# Altium schematic sheet llrf_afe_dds_channel.SchDoc
size 209 x 297 mm; SheetNumber: 2; SheetTotal: 17
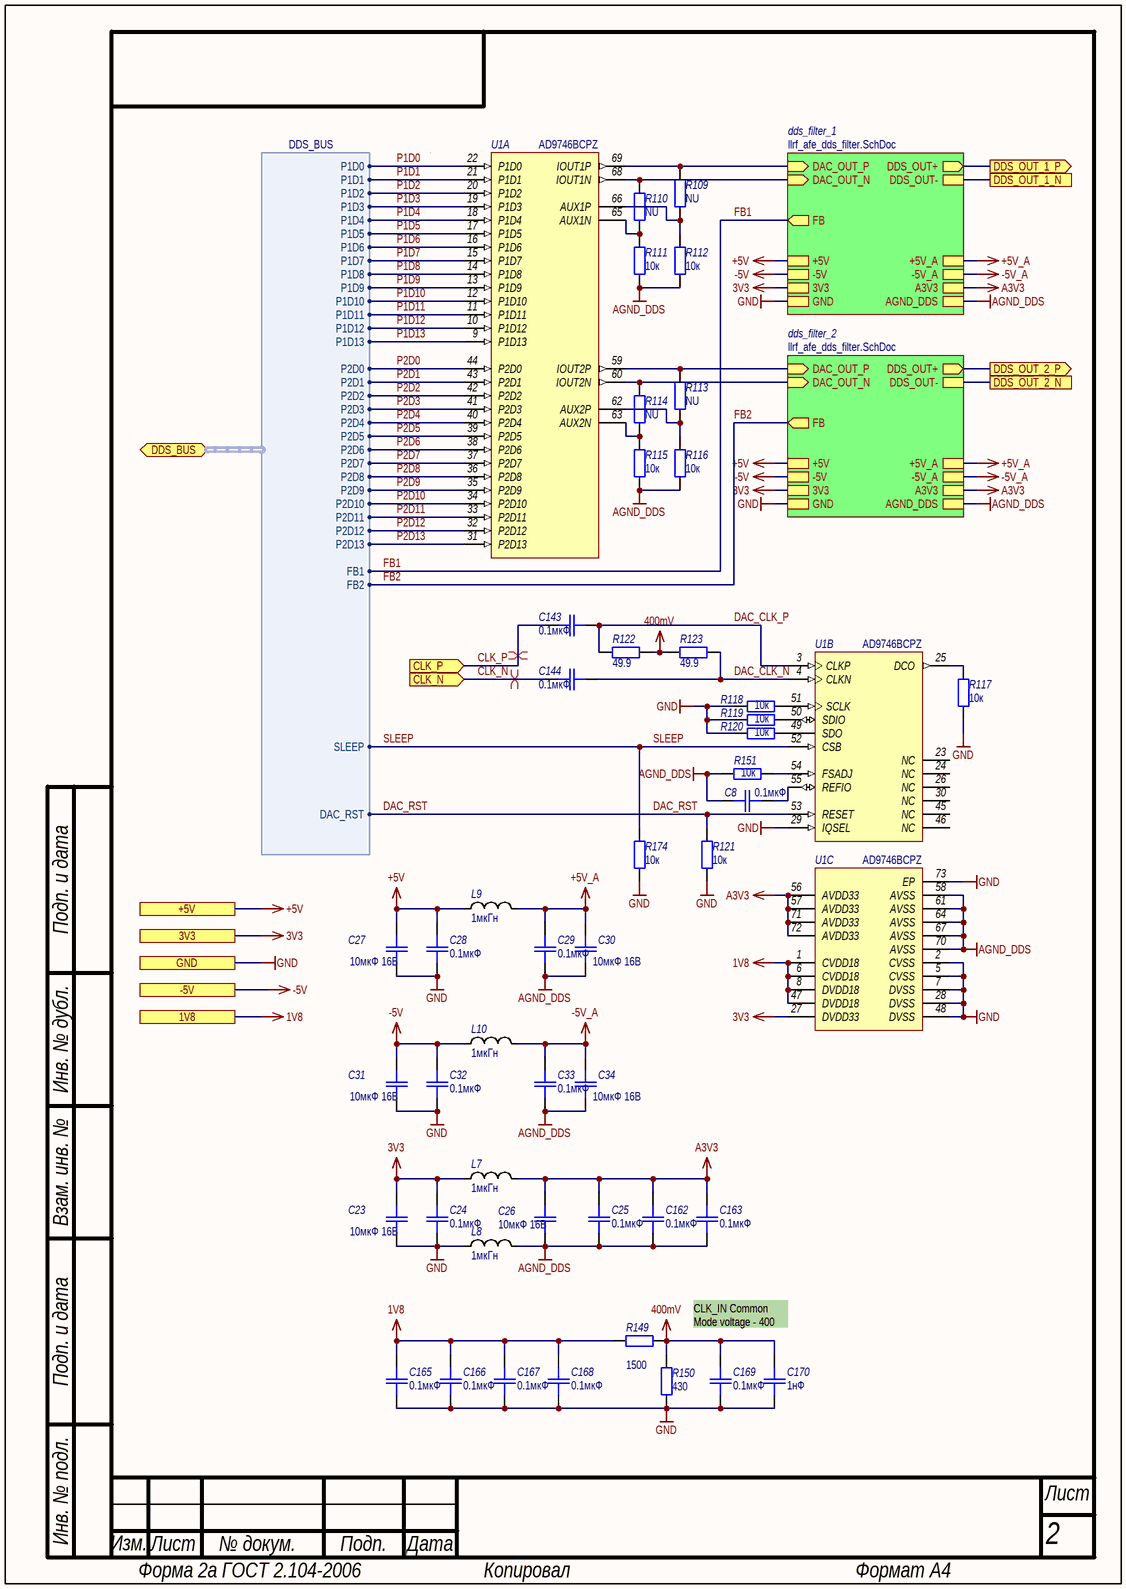
[diagram p0: llrf_afe_dds_channel.SchDoc]

## Parts
C8  0.1мкФ  [SMD_C0402]
C23  10мкФ 16В  [SMD_C0603]
C24  0.1мкФ  [SMD_C0402]
C25  0.1мкФ  [SMD_C0402]
C26  10мкФ 16В  [SMD_C0603]
C27  10мкФ 16В  [SMD_C0603]
C28  0.1мкФ  [SMD_C0402]
C29  0.1мкФ  [SMD_C0402]
C30  10мкФ 16В  [SMD_C0603]
C31  10мкФ 16В  [SMD_C0603]
C32  0.1мкФ  [SMD_C0402]
C33  0.1мкФ  [SMD_C0402]
C34  10мкФ 16В  [SMD_C0603]
C143  0.1мкФ  [SMD_C0402]
C144  0.1мкФ  [SMD_C0402]
C162  0.1мкФ  [SMD_C0402]
C163  0.1мкФ  [SMD_C0402]
C165  0.1мкФ  [SMD_C0402]
C166  0.1мкФ  [SMD_C0402]
C167  0.1мкФ  [SMD_C0402]
C168  0.1мкФ  [SMD_C0402]
C169  0.1мкФ  [SMD_C0402]
C170  1нФ  [SMD_C0402]
L7  1мкГн  [SMD_0805]
L8  1мкГн  [SMD_0805]
L9  1мкГн  [SMD_0805]
L10  1мкГн  [SMD_0805]
R109  NU  [SMD_0603]
R110  NU  [SMD_0603]
R111  10к  [SMD_0603]
R112  10к  [SMD_0603]
R113  NU  [SMD_0603]
R114  NU  [SMD_0603]
R115  10к  [SMD_0603]
R116  10к  [SMD_0603]
R117  10к  [SMD_0603]
R118  10к  [SMD_0603]
R119  10к  [SMD_0603]
R120  10к  [SMD_0603]
R121  10к  [SMD_0603]
R122  49.9  [SMD_0603]
R123  49.9  [SMD_0603]
R149  1500  [SMD_0603]
R150  430  [SMD_0603]
R151  10к  [SMD_0603]
R174  10к  [SMD_0603]
U1  AD9746BCPZ  [LFCSP-72]  (parts A,B,C of 3)

## Sub-sheets
dds_filter_1 = llrf_afe_dds_filter.SchDoc: DAC_OUT_P (in), -5V, DAC_OUT_N (in), +5V, GND, FB (out), +5V_A, DDS_OUT+ (out), A3V3, 3V3, AGND_DDS, -5V_A, DDS_OUT-
dds_filter_2 = llrf_afe_dds_filter.SchDoc: DAC_OUT_P (in), -5V, DAC_OUT_N (in), +5V, GND, FB (out), +5V_A, DDS_OUT+ (out), A3V3, 3V3, AGND_DDS, -5V_A, DDS_OUT-

## Ports
1V8, 3V3, +5V, -5V, CLK_N (in), CLK_P (in), DDS_BUS (bidir, harness DDS_BUS), DDS_OUT_1_N, DDS_OUT_1_P (out), DDS_OUT_2_N, DDS_OUT_2_P (out), GND

## Harnesses
DDS_BUS: P1D0, P1D1, P1D2, P1D3, P1D4, P1D5, P1D6, P1D7, P1D8, P1D9, P1D10, P1D11, P1D12, P1D13, P2D0, P2D1, P2D2, P2D3, P2D4, P2D5, P2D6, P2D7, P2D8, P2D9, P2D10, P2D11, P2D12, P2D13, FB1, SLEEP, DAC_RST, FB2

## Nets
1V8: C165.2 C166.2 C167.2 C168.2 R149.2 U1.1(CVDD18) U1.6(CVDD18) U1.8(DVDD18) U1.47(DVDD18) ; port 1V8
3V3: C23.2 C24.2 L7.1 U1.27(DVDD33) ; port 3V3, sheet dds_filter_1/3V3, sheet dds_filter_2/3V3
400mV: C169.1 C170.1 R122.1 R123.2 R149.1 R150.2
+5V: C27.2 C28.2 L9.1 ; port +5V, sheet dds_filter_1/+5V, sheet dds_filter_2/+5V
+5V_A: C29.2 C30.2 L9.2 ; sheet dds_filter_1/+5V_A, sheet dds_filter_2/+5V_A
-5V: C31.2 C32.2 L10.1 ; port -5V, sheet dds_filter_1/-5V, sheet dds_filter_2/-5V
-5V_A: C33.2 C34.2 L10.2 ; sheet dds_filter_1/-5V_A, sheet dds_filter_2/-5V_A
A3V3: C25.2 C26.2 C162.2 C163.2 L7.2 U1.56(AVDD33) U1.57(AVDD33) U1.71(AVDD33) U1.72(AVDD33) ; sheet dds_filter_1/A3V3, sheet dds_filter_2/A3V3
AGND_DDS: C8.1 C25.1 C26.1 C29.1 C30.1 C33.1 C34.1 C162.1 C163.1 L8.2 R111.1 R112.1 R115.1 R116.1 R151.1 U1.58(AVSS) U1.61(AVSS) U1.64(AVSS) U1.67(AVSS) U1.70(AVSS) ; sheet dds_filter_1/AGND_DDS, sheet dds_filter_2/AGND_DDS
GND: C23.1 C24.1 C27.1 C28.1 C31.1 C32.1 C165.1 C166.1 C167.1 C168.1 C169.2 C170.2 L8.1 R117.1 R118.2 R119.2 R120.2 R121.1 R150.1 R174.1 U1.2(CVSS) U1.5(CVSS) U1.7(DVSS) U1.28(DVSS) U1.29(IQSEL) U1.48(DVSS) U1.73(EP) ; port GND, sheet dds_filter_1/GND, sheet dds_filter_2/GND
CLK_N: C144.2 ; port CLK_N
CLK_P: C143.2 ; port CLK_P
DAC_CLK_N: C144.1 R123.1 U1.4(CLKN)
DAC_CLK_P: C143.1 R122.2 U1.3(CLKP)
DAC_RST: R121.2 U1.53(RESET) ; port DDS_BUS.DAC_RST
DDS_OUT_1_N: port DDS_OUT_1_N, sheet dds_filter_1/DDS_OUT-
DDS_OUT_1_P: port DDS_OUT_1_P, sheet dds_filter_1/DDS_OUT+
DDS_OUT_2_N: port DDS_OUT_2_N, sheet dds_filter_2/DDS_OUT-
DDS_OUT_2_P: port DDS_OUT_2_P, sheet dds_filter_2/DDS_OUT+
FB1: sheet dds_filter_1/FB, port DDS_BUS.FB1
FB2: sheet dds_filter_2/FB, port DDS_BUS.FB2
P1D0: U1.22(P1D0) ; port DDS_BUS.P1D0
P1D1: U1.21(P1D1) ; port DDS_BUS.P1D1
P1D2: U1.20(P1D2) ; port DDS_BUS.P1D2
P1D3: U1.19(P1D3) ; port DDS_BUS.P1D3
P1D4: U1.18(P1D4) ; port DDS_BUS.P1D4
P1D5: U1.17(P1D5) ; port DDS_BUS.P1D5
P1D6: U1.16(P1D6) ; port DDS_BUS.P1D6
P1D7: U1.15(P1D7) ; port DDS_BUS.P1D7
P1D8: U1.14(P1D8) ; port DDS_BUS.P1D8
P1D9: U1.13(P1D9) ; port DDS_BUS.P1D9
P1D10: U1.12(P1D10) ; port DDS_BUS.P1D10
P1D11: U1.11(P1D11) ; port DDS_BUS.P1D11
P1D12: U1.10(P1D12) ; port DDS_BUS.P1D12
P1D13: U1.9(P1D13) ; port DDS_BUS.P1D13
P2D0: U1.44(P2D0) ; port DDS_BUS.P2D0
P2D1: U1.43(P2D1) ; port DDS_BUS.P2D1
P2D2: U1.42(P2D2) ; port DDS_BUS.P2D2
P2D3: U1.41(P2D3) ; port DDS_BUS.P2D3
P2D4: U1.40(P2D4) ; port DDS_BUS.P2D4
P2D5: U1.39(P2D5) ; port DDS_BUS.P2D5
P2D6: U1.38(P2D6) ; port DDS_BUS.P2D6
P2D7: U1.37(P2D7) ; port DDS_BUS.P2D7
P2D8: U1.36(P2D8) ; port DDS_BUS.P2D8
P2D9: U1.35(P2D9) ; port DDS_BUS.P2D9
P2D10: U1.34(P2D10) ; port DDS_BUS.P2D10
P2D11: U1.33(P2D11) ; port DDS_BUS.P2D11
P2D12: U1.32(P2D12) ; port DDS_BUS.P2D12
P2D13: U1.31(P2D13) ; port DDS_BUS.P2D13
SLEEP: R174.2 U1.52(CSB) ; port DDS_BUS.SLEEP
NetC8_2: C8.2 U1.55(REFIO)
NetR109_1: R109.1 R112.2 U1.66(AUX1P)
NetR109_2: R109.2 U1.69(IOUT1P) ; sheet dds_filter_1/DAC_OUT_P
NetR110_1: R110.1 R111.2 U1.65(AUX1N)
NetR110_2: R110.2 U1.68(IOUT1N) ; sheet dds_filter_1/DAC_OUT_N
NetR113_1: R113.1 R116.2 U1.62(AUX2P)
NetR113_2: R113.2 U1.59(IOUT2P) ; sheet dds_filter_2/DAC_OUT_P
NetR114_1: R114.1 R115.2 U1.63(AUX2N)
NetR114_2: R114.2 U1.60(IOUT2N) ; sheet dds_filter_2/DAC_OUT_N
NetR117_2: R117.2 U1.25(DCO)
NetR118_1: R118.1 U1.51(SCLK)
NetR119_1: R119.1 U1.50(SDIO)
NetR120_1: R120.1 U1.49(SDO)
NetR151_2: R151.2 U1.54(FSADJ)

Not connected (* = marked no-connect by the designer): U1 23(NC) 24(NC) 26(NC) 30(NC) 45(NC) 46(NC)

## Layout directives
differential pair: CLK_N, CLK_P

## Notes on the sheet
- CLK_IN Common Mode voltage - 400 mV
- Подп. и дата
- Инв. № дубл.
- Взам. инв. №
- Инв. № подл.
- Изм.
- Лист
- № докум.
- Подп.
- Дата
- Форма 2а ГОСТ 2.104-2006
- Копировал
- Формат А4

## Library data of the parts
C8 C24 C25 C28 C29 C32 C33 C143 C144 C162 C163 C165-C170 = Capacitor: Назначение: SMD-конденсатор; Наименование: Конденсатор; Потребление, Вт: 0
  C8 C24 C25 C28 C29 C32 C33 C143 C144 C162 C163 C165-C169: Value: 0.1мкФ
  C170: Value: 1нФ
C23 C26 C27 C30 C31 C34 = Capacitor: Назначение: SMD-конденсатор; Наименование: GRM188C81C106MA73; Потребление, Вт: 0; Value: 10мкФ 16В
L7-L10 = Inductor: Наименование: Индуктивность; Назначение: SMD-индуктивность; Потребление, Вт: 0,010; Value: 1мкГн
R109-R123 R149-R151 R174 = Resistor: Наименование: Резистор; Назначение: SMD-резистор; Потребление, Вт: 0,001
  R109 R110 R113 R114: Value: NU
  R111 R112 R115-R121 R151 R174: Value: 10к
  R122 R123: Value: 49.9
  R149: Value: 1500
  R150: Value: 430
U1 = AD9746BCPZ: Dual 14-Bit Digital-to-Analog Converter, 250 Msps, -40 to +85 degC, CP-72-1, Pb-Free, Tray; Потребление, Вт: 0.355; Назначение: Dual 14-Bit Digital-to-Analog Converter, 250 Msps, -40 to +85 degC, CP-72-1, Pb-Free, Tray; ComponentLink1Description: DataSheet; ComponentLink1URL: http://www.analog.com/static/imported-files/data_sheets/AD9741_9743_9745_9746_9747.pdf; Наименование: AD9746BCPZ